# EAGLE board cs_debug_v1.1 (EAGLE 9.6.1), part 1 of 2
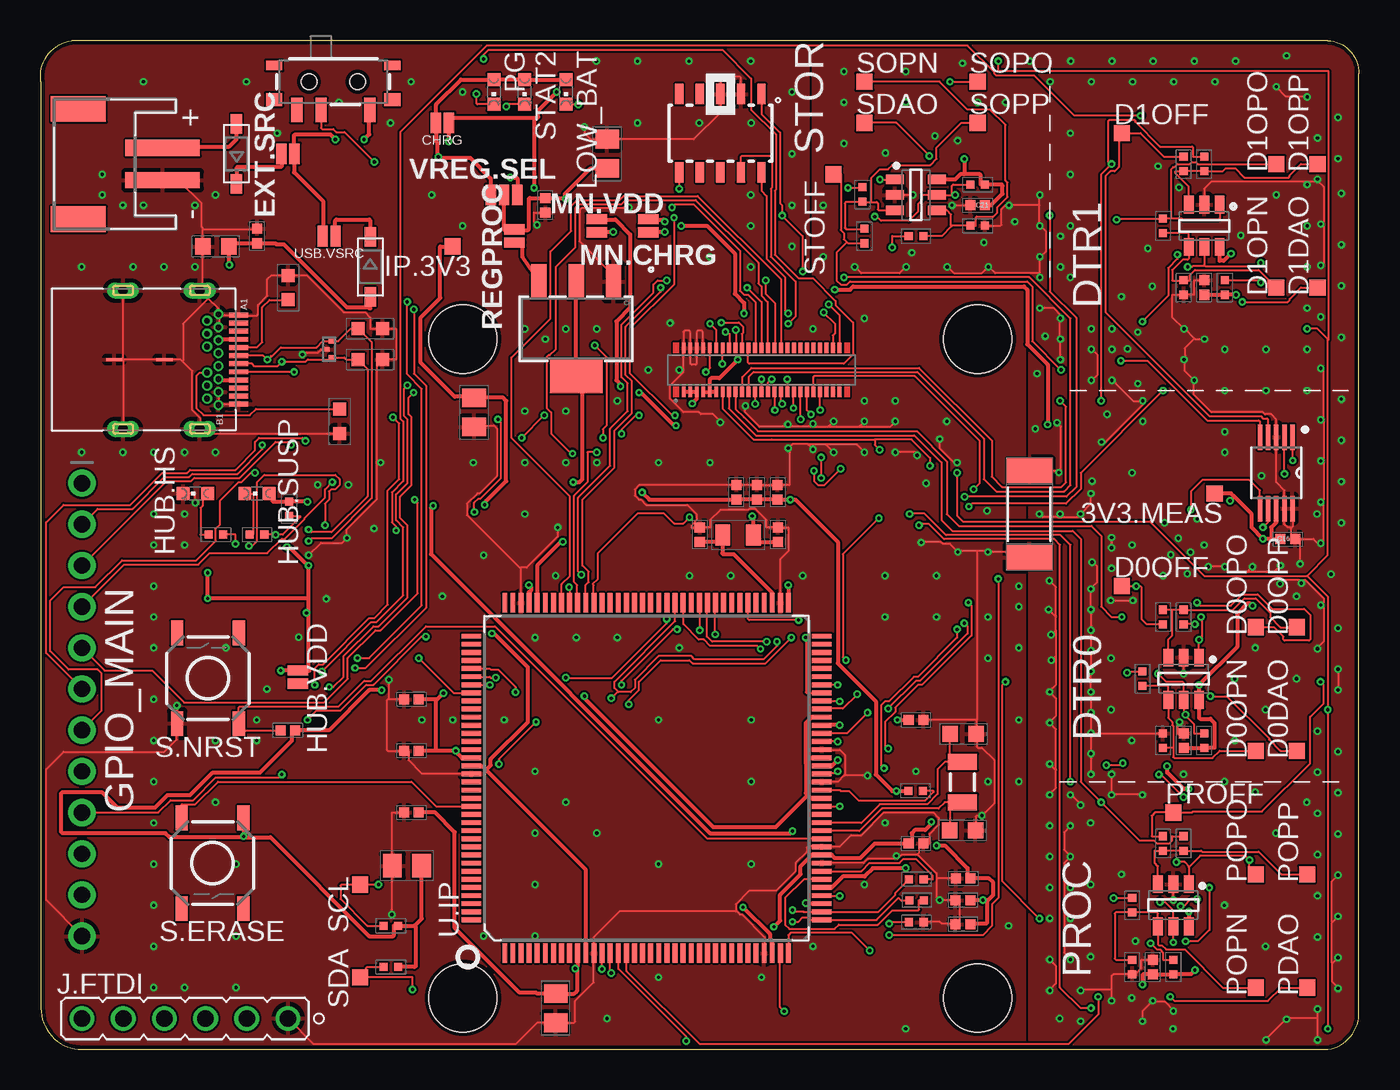
[diagram p10: board, top side]
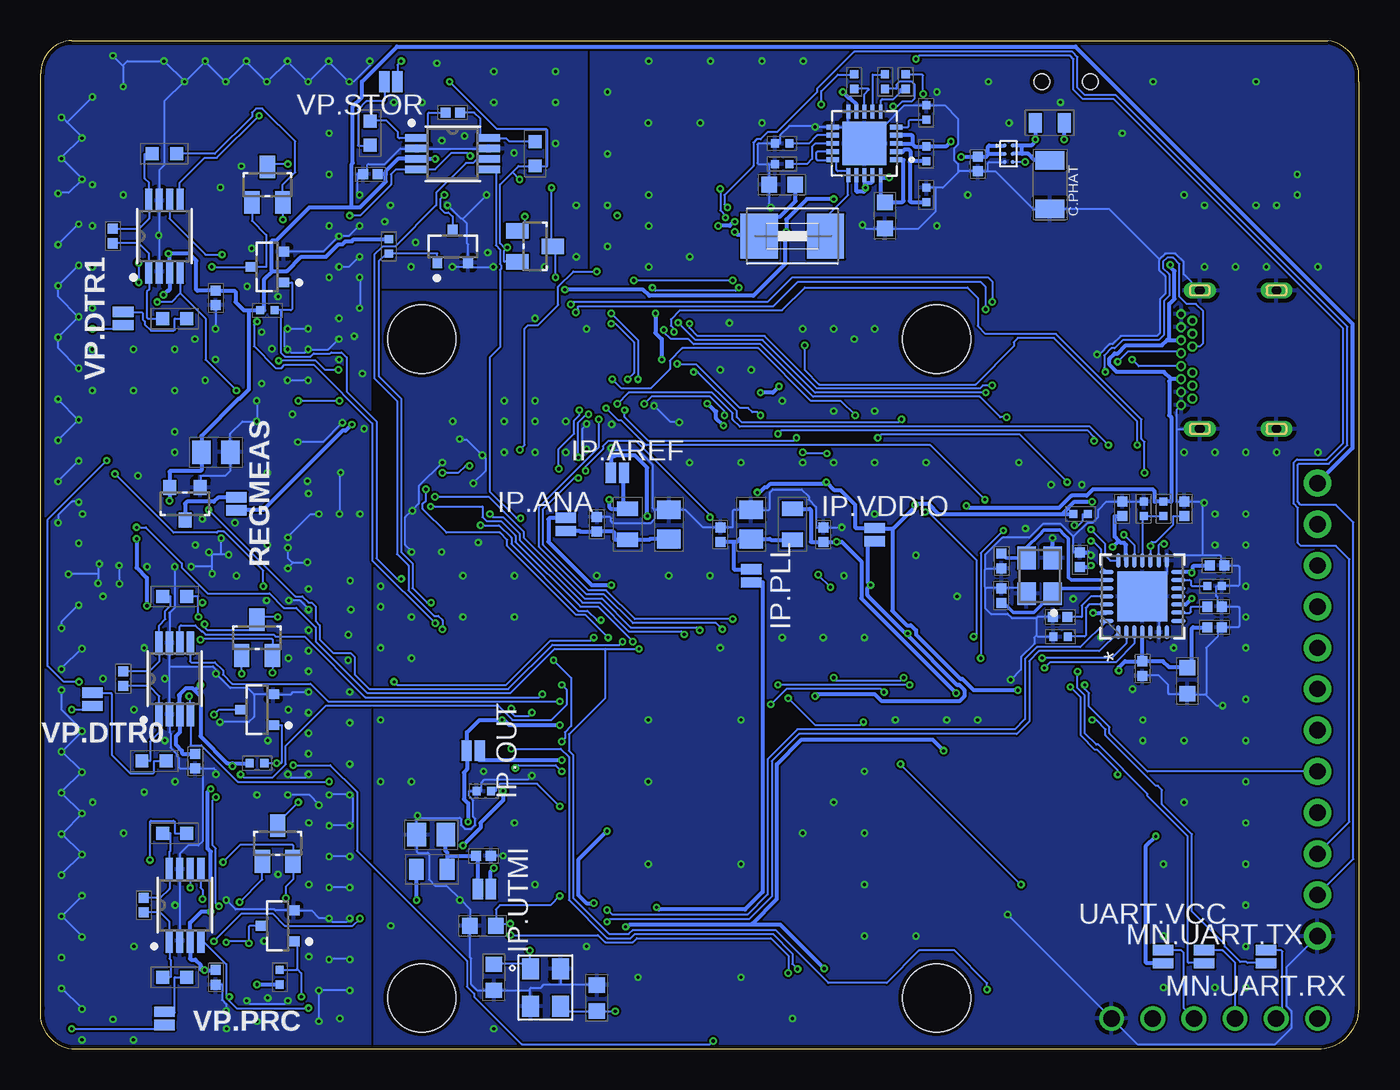
[diagram p11: board, bottom side, seen from below]

Size 81.32 x 62.23 mm. Coordinates in mm from the lower left corner, seen from the top.
Outline: 2.56,0 79.4,0 arc90 81.3,2.54 81.3,60.2 arc90 79.4,62.23 1.93,62.23 arc90 0.02,59.69 0.02,2.54 arc90 2.56,0
Copper layers (1*16): Top 0.035mm / dielectric 1.5mm / Bottom 0.035mm
Design rules "default *": minimum track width 5mil, minimum drill 0.2mm, track to track 5mil, track to pad 5mil, pad to pad 5mil, via to via 5mil, smd to smd 5mil, copper to edge 10mil, drill to drill 5mil, minimum pad ring 5mil, minimum via ring 5mil, stop-mask expansion 4mil, vias tented up to drill 0mil, thermal gap 10mil
Net classes: 1 power: width 0.254 mm; 2 power_5: width 0.254 mm; 5 10_mil: width 0.254 mm; 8 GND: width 0.127 mm
Holes 4.19 mm at 26.06,3.17 57.81,3.17 57.81,43.81 26.06,43.81

## Footprints (pad centres in the part's own frame; a part is rotated, then mirrored left to right if it is on the bottom)
TP10SQ = smd 1 x 1: TP 0,0
C0805 = smd 1.15 x 1.45: 1 -0.9,0; 2 0.9,0
C0402 = smd 0.62 x 0.62: 1 -0.45,0; 2 0.45,0
C0603 = smd 0.95 x 1: 1 -0.8,0; 2 0.8,0
C1206 = smd 1.15 x 1.8: 1 -1.5,0; 2 1.5,0
SMT-JUMPER_2_NC_PASTE_NO-SILK = smd 0.635 x 1.27: 1 -0.406,0; 2 0.406,0
SOD-123 = smd 1.2 x 0.7: A 1.85,0; C -1.85,0
1812 = smd 2.286 x 2.794: 1 -2.046,0; 2 2.046,0
CHIPLED_0603 = smd 0.8 x 0.8: A 0,-0.75; C 0,0.75
SAMTECH_FTSH-105-01 = smd 0.508 x 1.27: 1 -2.54,-2.413; 2 -2.54,2.413; 3 -1.27,-2.413; 4 -1.27,2.413; 5 0,-2.413; 6 0,2.413; 7 1.27,-2.413; 8 1.27,2.413; 9 2.54,-2.413; 10 2.54,2.413
HRS_DF40C-50DP-0.4V(51) = smd 0.23 x 0.66: 1 -4.8,1.355; 2 -4.8,-1.355; 3 -4.4,1.355; 4 -4.4,-1.355; 5 -4,1.355; 6 -4,-1.355; 7 -3.6,1.355; 8 -3.6,-1.355; 9 -3.2,1.355; 10 -3.2,-1.355; 11 -2.8,1.355; 12 -2.8,-1.355; 13 -2.4,1.355; 14 -2.4,-1.355; 15 -2,1.355; 16 -2,-1.355; 17 -1.6,1.355; 18 -1.6,-1.355; 19 -1.2,1.355; 20 -1.2,-1.355; 21 -0.8,1.355; 22 -0.8,-1.355; 23 -0.4,1.355; 24 -0.4,-1.355; 25 0,1.355; 26 0,-1.355; 27 0.4,1.355; 28 0.4,-1.355; 29 0.8,1.355; 30 0.8,-1.355; 31 1.2,1.355; 32 1.2,-1.355; 33 1.6,1.355; 34 1.6,-1.355; 35 2,1.355; 36 2,-1.355; 37 2.4,1.355; 38 2.4,-1.355; 39 2.8,1.355; 40 2.8,-1.355; 41 3.2,1.355; 42 3.2,-1.355; 43 3.6,1.355; 44 3.6,-1.355; 45 4,1.355; 46 4,-1.355; 47 4.4,1.355; 48 4.4,-1.355; 49 4.8,1.355; 50 4.8,-1.355
632723X00011 = smd 0.3 x 1.2: A1 -2.75,4.58; A2 -2.25,4.58; A3 -1.75,4.58; A4 -1.25,4.58; A5 -0.75,4.58; A6 -0.25,4.58; A7 0.25,4.58; A8 0.75,4.58; A9 1.25,4.58; A10 1.75,4.58; A11 2.25,4.58; A12 2.75,4.58 | drill 0.35 pad 0.584: B1 2.8,3.33; B2 2.4,2.63; B3 1.6,2.63; B4 1.2,3.33; B5 0.8,2.63; B6 0.4,3.33; B7 -0.4,3.33; B8 -0.8,2.63; B9 -1.2,3.33; B10 -1.6,2.63; B11 -2.4,2.63; B12 -2.8,3.33; GND 2,3.33; GND1 -2,3.33 | drill 0.6 pad 1 long: Z1 -4.27,2.18; Z2 4.27,2.18; Z3 4.27,-2.55; Z4 -4.27,-2.55 | smd 0.2 x 1: Z5 0,0; Z6 0,-3.1
JST-PH-2-SMT-RA = smd 1 x 4.6: 1 1,-3.7; 2 -1,-3.7 | smd 1.6 x 3.4: NC1 -3.4,1.5; NC2 3.4,1.5
HEADER-1X6 = drill 1.016: 1 0,-6.35; 2 0,-3.81; 3 0,-1.27; 4 0,1.27; 5 0,3.81; 6 0,6.35
1X12_ROUND = drill 1 pad 1.676: 1 -13.97,0; 2 -11.43,0; 3 -8.89,0; 4 -6.35,0; 5 -3.81,0; 6 -1.27,0; 7 1.27,0; 8 3.81,0; 9 6.35,0; 10 8.89,0; 11 11.43,0; 12 13.97,0
0805 = smd 0.8 x 1.2: 1 -0.9,0; 2 0.9,0
L0805 = smd 0.9 x 1.3: 1 -0.95,0; 2 0.95,0
SOT23-3_FDN340P = smd 0.95 x 1.4: D 0,1.1; G -0.95,-1.1; S 0.95,-1.1
SOT23-3_2N7002P = smd 0.6 x 0.7: D 0,1; G -0.95,-1; S 0.95,-1
R0402 = smd 0.5 x 0.5: 1 -0.45,0; 2 0.45,0
R0603 = smd 0.8 x 0.8: 1 -0.75,0; 2 0.75,0
R2010 = smd 1.499 x 2.794: 1 -2.667,0; 2 2.667,0
SWITCH_SPST_SMD_A = smd 0.7 x 1.5: 1 -2.25,-1.75; 2 -0.75,-1.75; 3 2.25,-1.75 | smd 1 x 0.6: GND1 -3.65,1; GND3 3.65,1 | smd 1 x 0.8: GND2 -3.65,-1.1; GND4 3.65,-1.1 | hole 0.95: -1.5,0; 1.5,0
TACTILE_SWITCH_SMD_5.2MM = smd 1.524 x 0.762: 1 -2.794,1.905; 2 2.794,1.905; 3 -2.794,-1.905; 4 2.794,-1.905
SOT23-3_AP2120N = smd 0.8 x 0.9: GND -0.95,-1; IN 0,1; OUT 0.95,-1
DCY4 = smd 0.95 x 2.15: GND -2.3,-2.9; IN 2.3,-2.9; OUT 0,-2.9 | smd 3.25 x 2.15: OUT_TAB 0,2.9
DMY0003A = smd 0.3 x 0.3: 1 -0.125,0; 2 0.125,-0.5; 3 0.125,0.5
DGK-MSOP8_INA225 = smd 1.45 x 0.45: GND -2.2,0.325; GS0 2.2,-0.975; GS1 2.2,-0.325; IN+ -2.2,0.975; IN- 2.2,0.975; OUT -2.2,-0.975; REF 2.2,0.325; VS -2.2,-0.325
OPA357AIDBVTG4 = smd 1.1 x 0.6: ENABLE 1.3,0; IN+ -1.3,-0.95; IN- 1.3,-0.95; OUT -1.3,0.95; VREF+ 1.3,0.95; VREF- -1.3,0
DGS10 = smd 1.575 x 0.279: 1 -2.2,1; 2 -2.2,0.5; 3 -2.2,0; 4 -2.2,-0.5; 5 -2.2,-1; 6 2.2,-1; 7 2.2,-0.5; 8 2.2,0; 9 2.2,0.5; 10 2.2,1
QFN50P400X400X100-21N = smd 0.81 x 0.26: 1 -1.955,1; 2 -1.955,0.5; 3 -1.955,0; 4 -1.955,-0.5; 5 -1.955,-1; 11 1.955,-1; 12 1.955,-0.5; 13 1.955,0; 14 1.955,0.5; 15 1.955,1 | smd 0.26 x 0.81: 6 -1,-1.955; 7 -0.5,-1.955; 8 0,-1.955; 9 0.5,-1.955; 10 1,-1.955; 16 1,1.955; 17 0.5,1.955; 18 0,1.955; 19 -0.5,1.955; 20 -1,1.955 | smd 2.7 x 2.7: 21 0,0
QFN28_5X5MC_MCH = smd 0.89 x 0.28: 1 -2.21,1.5; 2 -2.21,1; 3 -2.21,0.5; 4 -2.21,0; 5 -2.21,-0.5; 6 -2.21,-1; 7 -2.21,-1.5; 15 2.21,-1.5; 16 2.21,-1; 17 2.21,-0.5; 18 2.21,0; 19 2.21,0.5; 20 2.21,1; 21 2.21,1.5 | smd 0.28 x 0.89: 8 -1.5,-2.21; 9 -1,-2.21; 10 -0.5,-2.21; 11 0,-2.21; 12 0.5,-2.21; 13 1,-2.21; 14 1.5,-2.21; 22 1.5,2.21; 23 1,2.21; 24 0.5,2.21; 25 0,2.21; 26 -0.5,2.21; 27 -1,2.21; 28 -1.5,2.21 | smd 3.1 x 3.1: 29 0,0
WLCSP6_2X3 = smd 0.254 x 0.254: A1 -0.25,0.5; A2 0.25,0.5; B1 -0.25,0; B2 0.25,0; C1 -0.25,-0.5; C2 0.25,-0.5
LQFP144 = smd 0.3 x 1.2: 1 -8.75,-10.8; 2 -8.25,-10.8; 3 -7.75,-10.8; 4 -7.25,-10.8; 5 -6.75,-10.8; 6 -6.25,-10.8; 7 -5.75,-10.8; 8 -5.25,-10.8; 9 -4.75,-10.8; 10 -4.25,-10.8; 11 -3.75,-10.8; 12 -3.25,-10.8; 13 -2.75,-10.8; 14 -2.25,-10.8; 15 -1.75,-10.8; 16 -1.25,-10.8; 17 -0.75,-10.8; 18 -0.25,-10.8; 19 0.25,-10.8; 20 0.75,-10.8; 21 1.25,-10.8; 22 1.75,-10.8; 23 2.25,-10.8; 24 2.75,-10.8; 25 3.25,-10.8; 26 3.75,-10.8; 27 4.25,-10.8; 28 4.75,-10.8; 29 5.25,-10.8; 30 5.75,-10.8; 31 6.25,-10.8; 32 6.75,-10.8; 33 7.25,-10.8; 34 7.75,-10.8; 35 8.25,-10.8; 36 8.75,-10.8; 73 8.75,10.8; 74 8.25,10.8; 75 7.75,10.8; 76 7.25,10.8; 77 6.75,10.8; 78 6.25,10.8; 79 5.75,10.8; 80 5.25,10.8; 81 4.75,10.8; 82 4.25,10.8; 83 3.75,10.8; 84 3.25,10.8; 85 2.75,10.8; 86 2.25,10.8; 87 1.75,10.8; 88 1.25,10.8; 89 0.75,10.8; 90 0.25,10.8; 91 -0.25,10.8; 92 -0.75,10.8; 93 -1.25,10.8; 94 -1.75,10.8; 95 -2.25,10.8; 96 -2.75,10.8; 97 -3.25,10.8; 98 -3.75,10.8; 99 -4.25,10.8; 100 -4.75,10.8; 101 -5.25,10.8; 102 -5.75,10.8; 103 -6.25,10.8; 104 -6.75,10.8; 105 -7.25,10.8; 106 -7.75,10.8; 107 -8.25,10.8; 108 -8.75,10.8 | smd 1.2 x 0.3: 37 10.8,-8.75; 38 10.8,-8.25; 39 10.8,-7.75; 40 10.8,-7.25; 41 10.8,-6.75; 42 10.8,-6.25; 43 10.8,-5.75; 44 10.8,-5.25; 45 10.8,-4.75; 46 10.8,-4.25; 47 10.8,-3.75; 48 10.8,-3.25; 49 10.8,-2.75; 50 10.8,-2.25; 51 10.8,-1.75; 52 10.8,-1.25; 53 10.8,-0.75; 54 10.8,-0.25; 55 10.8,0.25; 56 10.8,0.75; 57 10.8,1.25; 58 10.8,1.75; 59 10.8,2.25; 60 10.8,2.75; 61 10.8,3.25; 62 10.8,3.75; 63 10.8,4.25; 64 10.8,4.75; 65 10.8,5.25; 66 10.8,5.75; 67 10.8,6.25; 68 10.8,6.75; 69 10.8,7.25; 70 10.8,7.75; 71 10.8,8.25; 72 10.8,8.75; 109 -10.8,8.75; 110 -10.8,8.25; 111 -10.8,7.75; 112 -10.8,7.25; 113 -10.8,6.75; 114 -10.8,6.25; 115 -10.8,5.75; 116 -10.8,5.25; 117 -10.8,4.75; 118 -10.8,4.25; 119 -10.8,3.75; 120 -10.8,3.25; 121 -10.8,2.75; 122 -10.8,2.25; 123 -10.8,1.75; 124 -10.8,1.25; 125 -10.8,0.75; 126 -10.8,0.25; 127 -10.8,-0.25; 128 -10.8,-0.75; 129 -10.8,-1.25; 130 -10.8,-1.75; 131 -10.8,-2.25; 132 -10.8,-2.75; 133 -10.8,-3.25; 134 -10.8,-3.75; 135 -10.8,-4.25; 136 -10.8,-4.75; 137 -10.8,-5.25; 138 -10.8,-5.75; 139 -10.8,-6.25; 140 -10.8,-6.75; 141 -10.8,-7.25; 142 -10.8,-7.75; 143 -10.8,-8.25; 144 -10.8,-8.75
SMT-JUMPER_2_NO_PASTEFREE_NO-SILK = smd 0.635 x 1.27: 1 -0.406,0; 2 0.406,0
SMT-JUMPER_3_1-NC_PASTE_NO-SILK = smd 0.635 x 1.27: 1 -0.813,0; 2 0,0; 3 0.813,0
XTAL_EPSON_TSX3225 = smd 1.4 x 1.15: 1 -1.1,-0.8; 2 1.1,-0.8; 3 1.1,0.8; 4 -1.1,0.8
CRYSTAL-SMD-3.2X1.5MM = smd 1 x 1.8: P$1 -1.25,0; P$2 1.25,0
CRYSTAL-3.2-2.5 = smd 1.3 x 1.05: 1 -1.15,-0.925; 2 1.15,-0.925; 3 1.15,0.925; 4 -1.15,0.925

## Placement (x,y rotation side)
3V3.MEAS  TPTP10SQ  [TP10SQ]  72.41,34.29 180 top
C1  10u  [C0805]  70.51,36.83 0 bottom
C2  10u  [C0805]  26.74,39.29 270 top
C3  0.1u  [C0402]  31.14,52.07 270 top
C4  0.1u  [C0402]  8.91,27.3 0 bottom
C5  0.1u  [C0402]  18.44,26.67 180 bottom
C6  0.1u  [C0402]  74.95,8.89 270 bottom
C7  0.1u  [C0402]  76.22,22.86 270 bottom
C8  0.1u  [C0402]  68.6,5.08 90 top
C9  0.1u  [C0402]  70.51,4.45 270 bottom
C10  0.1u  [C0402]  55.9,57.78 180 bottom
C11  0.1u  [C0402]  70.51,19.05 90 top
C12  0.1u  [C0402]  71.78,17.78 270 bottom
C13  0.1u  [C0402]  76.86,50.16 270 bottom
C14  0.1u  [C0402]  71.78,46.99 90 top
C15  0.1u  [C0402]  70.51,46.35 270 bottom
C16  0.1u  [C0402]  76.93,31.47 0 top
C17  16pF  [C0603]  47.01,3.17 90 bottom
C18  4.7u  [C0603]  35.58,53.34 180 bottom
C19  16pF  [C0603]  53.36,4.45 270 bottom
C21  0.1u  [C0402]  57.81,52.07 180 top
C22  0.1u  [C0402]  45.49,31.75 90 top
C23  22u  [C0805]  31.77,2.54 270 top
C24  22u  [C0805]  37.49,32.38 90 bottom
C25  22u  [C0805]  42.57,32.38 90 bottom
C26  22u  [C0805]  57.22,13.23 180 bottom
C27  22u  [C0805]  22.6,11.33 180 top
C28  10n  [C0402]  15.26,19.68 180 top
C29  0.1u  [C0402]  40.66,31.75 90 top
C30  0.1u  [C0402]  54,12.7 0 top
C31  0.1u  [C0402]  22.88,14.61 180 top
C32  0.1u  [C0402]  33.04,31.75 90 bottom
C33  0.1u  [C0402]  22.88,18.41 180 top
C34  0.1u  [C0402]  54,20.32 0 top
C35  0.1u  [C0402]  22.88,21.59 180 top
C36  0.1u  [C0402]  39.39,31.75 90 bottom
C37  0.1u  [C0402]  56.89,9.19 180 top
C38  0.1u  [C0402]  56.92,10.54 180 top
C39  0.1u  [C0402]  56.89,7.72 180 top
C40  0.1u  [C0402]  45.46,34.37 90 top
C41  0.1u  [C0402]  44.19,34.37 90 top
C42  0.1u  [C0402]  42.92,34.37 90 top
C43  0.1u  [C0402]  54,11.94 0 bottom
C44  0.1u  [C0402]  47.01,32.38 90 bottom
C45  0.1u  [C0402]  60.98,53.98 180 bottom
C46  2.2uF  [C0603]  10.82,49.53 180 top
C47  1u  [C0402]  13.36,50.16 90 top
C48  0.1u  [C0402]  10.76,33.35 90 bottom
C49  0.1u  [C0402]  13.36,23.5 270 bottom
C50  0.1u  [C0402]  8.76,29.84 0 bottom
C51  0.1u  [C0402]  8.91,26.04 0 bottom
C52  0.1u  [C0402]  17.22,30.2 90 bottom
C53  0.1u  [C0402]  14.6,33.35 90 bottom
C54  4.7u  [C0603]  10.59,22.73 270 bottom
C55  18pF  [C0402]  22.07,27.99 90 bottom
C56  18pF  [C0402]  22.04,30.12 270 bottom
C57  1u  [C0402]  23.52,54.61 270 bottom
C103  16pF  [C0603]  56.92,19.46 0 top
C107  16pF  [C0603]  56.87,13.51 0 top
C108  10pF  [C0603]  54.05,7.62 180 bottom
C205  22u  [C0805]  34.95,55.24 90 top
C208  4.7u  [C0603]  29.23,51.44 270 bottom
C.PHAT  47u  [C1206]  19.07,53.34 270 bottom
CHRG  JUMPER-SMT_2_NC_PASTE_NO-SILK  [SMT-JUMPER_2_NC_PASTE_NO-SILK]  24.79,57.15 180 top
D0DAO  TPSTP10SQ  [TP10SQ]  77.49,18.41 90 top
D0OFF  TPSTP10SQ  [TP10SQ]  66.7,28.57 0 top
D0OPN  TPSTP10SQ  [TP10SQ]  74.95,18.41 90 top
D0OPO  TPSTP10SQ  [TP10SQ]  74.95,26.04 90 top
D0OPP  TPSTP10SQ  [TP10SQ]  77.49,26.04 90 top
D1  MBR120VLSFT3GOSCT-ND  [SOD-123]  12.09,55.24 90 top
D1DAO  TPSTP10SQ  [TP10SQ]  78.76,46.99 90 top
D1OFF  TPSTP10SQ  [TP10SQ]  66.7,56.52 180 top
D1OPN  TPSTP10SQ  [TP10SQ]  76.22,46.99 90 top
D1OPO  TPSTP10SQ  [TP10SQ]  76.22,54.61 90 top
D1OPP  TPSTP10SQ  [TP10SQ]  78.76,54.61 90 top
D2  MBR120VLSFT3GOSCT-ND  [SOD-123]  20.34,48.26 270 top
EXT.SRC  JUMPER-SMT_2_NC_PASTE_NO-SILK  [SMT-JUMPER_2_NC_PASTE_NO-SILK]  15.26,55.24 0 top
F2  MF-MSMF050-2  [1812]  34.95,50.16 0 bottom
HUB.HS  [CHIPLED_0603]  9.55,34.29 90 top
HUB.SUSP  [CHIPLED_0603]  13.36,34.29 90 top
HUB.VDD  JUMPER-SMT_2_NC_PASTE_NO-SILK  [SMT-JUMPER_2_NC_PASTE_NO-SILK]  15.87,22.96 90 top
IP.3V3  TPTP10SQ  [TP10SQ]  25.42,49.53 90 top
IP.ANA  JUMPER-SMT_2_NC_PASTE_NO-SILK  [SMT-JUMPER_2_NC_PASTE_NO-SILK]  48.92,32.38 270 bottom
IP.AREF  JUMPER-SMT_2_NC_PASTE_NO-SILK  [SMT-JUMPER_2_NC_PASTE_NO-SILK]  45.74,35.56 180 bottom
IP.OUT  JUMPER-SMT_2_NC_PASTE_NO-SILK  [SMT-JUMPER_2_NC_PASTE_NO-SILK]  54.63,18.41 180 bottom
IP.PLL  JUMPER-SMT_2_NC_PASTE_NO-SILK  [SMT-JUMPER_2_NC_PASTE_NO-SILK]  37.49,29.21 90 bottom
IP.UTMI  JUMPER-SMT_2_NC_PASTE_NO-SILK  [SMT-JUMPER_2_NC_PASTE_NO-SILK]  53.94,9.88 180 bottom
IP.VDDIO  JUMPER-SMT_2_NC_PASTE_NO-SILK  [SMT-JUMPER_2_NC_PASTE_NO-SILK]  29.87,31.75 90 bottom
J1  J-JTAG-CORTEX_SMD  [SAMTECH_FTSH-105-01]  41.93,56.52 180 top
J3  HIROSE-DF40_50-PIN_CONNECTORS-HEADER  [HRS_DF40C-50DP-0.4V(51)]  44.47,41.91 0 top
J5  J-WURTH-USBC  [632723X00011]  7.64,42.55 270 top
J19  Solar  [JST-PH-2-SMT-RA]  3.83,54.61 90 top
J.FTDI  J-SERIAL-PORT  [HEADER-1X6]  8.91,1.91 90 top
JP1  [1X12_ROUND]  2.56,20.95 270 top
L1  3.3µH/±20%/450mA  [0805]  19.07,57.15 180 bottom
L101  MH2029-300Y  [L0805]  45.11,32.38 270 bottom
L102  MH2029-300Y  [L0805]  57.2,11.1 0 bottom
L103  MH2029-300Y  [L0805]  43.02,31.72 180 top
L104  MH2029-300Y  [L0805]  34.95,32.38 270 bottom
LOW_BAT  [CHIPLED_0603]  32.41,59.05 180 top
MN.CHRG  JUMPER-SMT_2_NC_PASTE_NO-SILK  [SMT-JUMPER_2_NC_PASTE_NO-SILK]  37.49,50.8 90 top
MN.UART.RX  JUMPER-SMT_2_NC_PASTE_NO-SILK  [SMT-JUMPER_2_NC_PASTE_NO-SILK]  5.74,5.71 90 bottom
MN.UART.TX  JUMPER-SMT_2_NC_PASTE_NO-SILK  [SMT-JUMPER_2_NC_PASTE_NO-SILK]  9.55,5.71 90 bottom
MN.VDD  JUMPER-SMT_2_NC_PASTE_NO-SILK  [SMT-JUMPER_2_NC_PASTE_NO-SILK]  34.31,50.8 90 top
PDAO  TPSTP10SQ  [TP10SQ]  78.13,3.81 90 top
PG  [CHIPLED_0603]  27.96,59.05 180 top
POPN  TPSTP10SQ  [TP10SQ]  74.95,3.81 90 top
POPO  TPSTP10SQ  [TP10SQ]  74.95,10.79 90 top
POPP  TPSTP10SQ  [TP10SQ]  78.13,10.79 90 top
PROFF  TPSTP10SQ  [TP10SQ]  69.87,14.61 0 top
Q3  FDN340P  [SOT23-3_FDN340P]  66.7,12.7 0 bottom
Q4  2N7002P  [SOT23-3_2N7002P]  66.7,7.62 90 bottom
Q5  FDN340P  [SOT23-3_FDN340P]  67.33,53.34 0 bottom
Q6  2N7002P  [SOT23-3_2N7002P]  67.33,48.26 90 bottom
Q7  FDN340P  [SOT23-3_FDN340P]  67.97,25.4 0 bottom
Q8  2N7002P  [SOT23-3_2N7002P]  67.97,20.95 90 bottom
Q9  FDN340P  [SOT23-3_FDN340P]  50.82,49.53 270 bottom
Q10  2N7002P  [SOT23-3_2N7002P]  55.9,49.53 0 bottom
R1  51k  [R0402]  15.34,33.35 270 top
R2  1.5k  [R0402]  31.14,59.69 90 bottom
R3  1.5k  [R0402]  29.23,59.69 270 bottom
R4  4.7k  [R0402]  21.61,7.62 180 top
R5  4.7k  [R0402]  21.61,5.08 180 top
R6  1.15k  [R0402]  27.96,59.69 90 bottom
R7  100k  [R0402]  8.91,28.57 180 bottom
R8  100k  [R0402]  53.97,15.93 180 bottom
R9  750  [R0402]  13.36,31.75 0 top
R10  270  [R0402]  10.82,31.75 0 top
R16  249k  [R0402]  69.24,12.7 270 top
R17  10k  [R0402]  70.51,12.7 270 top
R18  100k  [R0402]  69.87,5.08 270 top
R19  10k  [R0402]  67.33,8.89 90 top
R20  249k  [R0402]  67.33,5.08 90 top
R21  10k  [R0402]  66.57,4.45 270 bottom
R22  5.1  [R0603]  73.05,13.34 180 bottom
R23  5.1  [R0603]  73.05,4.45 180 bottom
R24  249k  [R0402]  70.51,54.61 270 top
R25  249k  [R0402]  69.24,26.67 90 top
R26  10k  [R0402]  70.51,26.67 90 top
R27  100k  [R0402]  71.78,19.05 270 top
R28  10k  [R0402]  67.97,22.86 90 top
R29  249k  [R0402]  69.24,19.05 270 top
R30  10k  [R0402]  67.97,17.65 180 bottom
R31  5.1  [R0603]  73.05,27.94 180 bottom
R32  5.1  [R0603]  74.32,17.78 180 bottom
R33  10k  [R0402]  71.78,54.61 270 top
R34  100k  [R0402]  73.05,46.99 270 top
R35  10k  [R0402]  69.24,50.8 90 top
R36  249k  [R0402]  70.51,46.99 90 top
R37  10k  [R0402]  67.33,45.59 180 bottom
R38  5.1  [R0603]  73.68,55.24 180 bottom
R39  5.1  [R0603]  73.05,45.09 180 bottom
R40  249k  [R0402]  50.82,50.16 90 top
R41  100k  [R0402]  53.97,15.95 0 top
R42  5.1k  [R0603]  15.26,46.99 270 top
R43  5.1k  [R0603]  18.44,38.73 90 top
R46  100k  [R0402]  13.28,33.35 270 bottom
R47  100k  [R0402]  12.06,33.35 90 bottom
R48  12k  [R0402]  18.41,25.45 0 bottom
R49  100k  [R0402]  17.17,33.02 180 bottom
R53  10k  [R0402]  50.69,52.73 270 top
R54  100k  [R0402]  57.81,53.34 0 top
R55  10k  [R0402]  54,50.16 180 top
R56  249k  [R0402]  57.81,50.8 180 top
R57  10k  [R0402]  59.84,49.53 90 bottom
R58  5.1  [R0603]  50.82,55.24 90 bottom
R59  5.1  [R0603]  60.98,56.52 90 bottom
R101  39  [R0402]  54.02,10.49 0 top
R102  39  [R0402]  54.05,9.19 0 top
R103  6.8k  [R0402]  54.02,7.85 180 top
R201  270k  [R0402]  26.69,55.24 90 bottom
R202  100k  [R0402]  26.69,52.7 270 bottom
R203  2k  [R0402]  35.58,54.61 0 bottom
R204  100k  [R0402]  35.58,55.88 0 bottom
R206  10k  [R0402]  26.69,57.78 270 bottom
R.GND  0  [R2010]  60.98,33.02 90 top
REGMEAS  JUMPER-SMT_2_NC_PASTE_NO-SILK  [SMT-JUMPER_2_NC_PASTE_NO-SILK]  69.24,33.66 90 bottom
REGPROC  JUMPER-SMT_2_NC_PASTE_NO-SILK  [SMT-JUMPER_2_NC_PASTE_NO-SILK]  29.23,50.16 270 top
S201  [SWITCH_SPST_SMD_A]  18.05,59.69 0 top
S.ERASE  Momentary  [TACTILE_SWITCH_SMD_5.2MM]  10.61,11.48 270 top
S.NRST  Momentary  [TACTILE_SWITCH_SMD_5.2MM]  10.33,22.89 90 top
SCL  TPTP10SQ  [TP10SQ]  19.71,10.16 180 top
SDA  TPTP10SQ  [TP10SQ]  19.71,4.45 180 top
SDAO  TPSTP10SQ  [TP10SQ]  50.82,57.15 0 top
SOPN  TPSTP10SQ  [TP10SQ]  50.82,59.69 0 top
SOPO  TPSTP10SQ  [TP10SQ]  57.81,59.69 0 top
SOPP  TPSTP10SQ  [TP10SQ]  57.81,57.15 0 top
STAT2  [CHIPLED_0603]  29.87,59.05 180 top
STOFF  TPSTP10SQ  [TP10SQ]  48.92,53.98 90 top
U1  AP2120N-3.3TRG1  [SOT23-3_AP2120N]  72.41,33.66 180 bottom
U2  TLV1117LV33DCYR  [DCY4]  33.04,44.45 180 top
U3  ESD122DMYR  [DMY0003A]  17.8,43.18 0 top
U5  INA225AIDGK  [DGK-MSOP8_INA225]  72.41,8.89 90 bottom
U6  OPA357AIDBVTG4  [OPA357AIDBVTG4]  69.87,8.89 270 top
U7  INA225AIDGK  [DGK-MSOP8_INA225]  73.05,22.86 90 bottom
U8  OPA357AIDBVTG4  [OPA357AIDBVTG4]  70.51,22.86 270 top
U9  INA225AIDGK  [DGK-MSOP8_INA225]  73.68,50.16 90 bottom
U10  OPA357AIDBVTG4  [OPA357AIDBVTG4]  71.78,50.8 270 top
U11  DAC7574IDGS  [DGS10]  76.22,35.56 270 top
U12  MCP73871T-2CCI/ML  [QFN50P400X400X100-21N]  30.5,55.88 180 bottom
U13  USB2412-DZK  [QFN28_5X5MC_MCH]  13.36,27.94 90 bottom
U14  INA225AIDGK  [DGK-MSOP8_INA225]  55.9,55.24 0 bottom
U15  OPA357AIDBVTG4  [OPA357AIDBVTG4]  54,52.7 0 top
U204  LOADSWITCH-MIC94164  [WLCSP6_2X3]  21.61,55.24 0 bottom
U.IP  ATSAM3X8EA-AU  [LQFP144]  37.38,16.74 0 top
UART.VCC  JUMPER-SMT_2_NO_PASTEFREE  [SMT-JUMPER_2_NO_PASTEFREE_NO-SILK]  12.09,5.71 90 bottom
USB.VSRC  JUMPER-SMT_2_NC_PASTE_NO-SILK  [SMT-JUMPER_2_NC_PASTE_NO-SILK]  17.8,50.16 180 top
VP.DTR0  JUMPER-SMT_2_NC_PASTE_NO-SILK  [SMT-JUMPER_2_NC_PASTE_NO-SILK]  78.13,21.59 90 bottom
VP.DTR1  JUMPER-SMT_2_NC_PASTE_NO-SILK  [SMT-JUMPER_2_NC_PASTE_NO-SILK]  76.22,45.09 90 bottom
VP.PRC  JUMPER-SMT_2_NC_PASTE_NO-SILK  [SMT-JUMPER_2_NC_PASTE_NO-SILK]  73.68,1.91 90 bottom
VP.STOR  JUMPER-SMT_2_NC_PASTE_NO-SILK  [SMT-JUMPER_2_NC_PASTE_NO-SILK]  59.71,59.69 180 bottom
VR3  VARISTOR  [R0603]  20.34,42.55 0 top
VR4  VARISTOR  [R0603]  20.34,44.45 0 top
VREG.SEL  JUMPER-SMT_3_1-NC_PASTE_NO-SILK  [SMT-JUMPER_3_1-NC_PASTE_NO-SILK]  28.6,52.7 0 top
Y1  EPSON_TSX-3225_24.0000MF10Z-C3  [XTAL_EPSON_TSX3225]  19.71,29.21 90 bottom
Y101  32.768kHz  [CRYSTAL-SMD-3.2X1.5MM]  56.87,16.48 90 top
Y102  12MHz-12pF-K7  [CRYSTAL-3.2-2.5]  50.19,3.81 270 bottom

## Tracks (layer width: path | path; a pad name or v marks a point on that pad's centre or on a via)
3V3_INSTR_MEAS  (via drill 0.2)
  Top 0.254: C11.1 R27.2 71.84,18.61 72.41,18.61 72.41,20.13 72.16,20.38 71.52,20.38 71.46,20.45 71.46,21.53 U8.VREF+ 71.46,21.65 v71.46,22.48 73.81,24.83 73.81,26.86 74.44,27.5 74.63,27.5 v74.76,27.37 | v67.97,4 67.97,4.57 68.03,4.64 C8.1 68.66,4.64 R18.2 69.93,4.64 70.95,4.64 v71.2,4.89 | v70.82,8.51 70.82,7.62 U6.VREF+ | v69.49,17.46 69.49,17.08 70.51,16.07 v70.82,16.07 | 75.9,31.5 76.47,31.5 C16.1 | 75.9,31.5 75.9,32.19 76.22,32.51 U11.8 | 3V3.MEAS.TP 73.43,34.29 73.62,34.1 | 73.62,34.1 74.7,33.02 74.7,32.19 v75.39,31.5 75.9,31.5 | C21.1 58.63,52.07 59.33,52.77 59.33,53.28 59.27,53.34 R54.2 58,53.34 58,53.91 57.93,53.98 56.98,53.98 | 56.98,53.98 56.73,53.98 56.41,53.66 55.33,53.66 U15.VREF+ | C14.1 R34.2 73.11,46.55 v73.74,46.55 | v73.43,49.09 72.98,48.64 72.73,48.64 72.73,49.47 U10.VREF+ | v56.98,54.93 56.98,53.98 | v73.36,33.85 73.62,34.1
  Bottom 0.254: 69.49,17.65 69.81,17.65 71.46,19.3 71.46,21.78 71.81,22.13 | 69.49,17.65 R30.2 | 71.81,22.13 71.97,22.29 72.35,22.29 72.79,21.84 72.73,21.78 72.73,20.7 U7.VS 72.73,20.57 72.73,19.56 72.98,19.3 72.98,18.8 72.6,18.41 72.6,18.29 72.54,18.22 C12.1 | 71.81,22.13 v71.46,22.48 | v67.97,4 R21.2 | C9.1 v71.2,4.89 71.39,4.89 71.46,4.95 71.46,5.21 71.78,5.52 72.03,5.52 72.09,5.59 72.09,6.67 U5.VS 72.09,6.79 72.09,7.81 71.39,8.51 v70.82,8.51 70.82,12.19 71.01,12.38 71.01,15.88 v70.82,16.07 | v69.49,17.46 69.49,17.65 | v73.74,46.55 73.49,46.8 73.43,46.8 73.36,46.86 73.36,47.94 U9.VS 73.36,48.07 73.36,49.02 v73.43,49.09 72.16,49.09 71.71,48.64 71.71,46.86 71.65,46.8 70.57,46.8 C15.1 69.36,46.8 69.3,46.74 69.3,46.1 68.79,45.59 68.47,45.59 | 60.03,53.98 C45.1 | 60.03,53.98 60.03,54.17 59.27,54.93 58.12,54.93 U14.VS 58,54.93 v56.98,54.93 | 68.47,45.59 R37.2 67.52,45.59 67.52,47.5 67.01,48.01 | 67.01,48.01 66.12,48.01 65.24,48.9 63.71,48.9 62.95,49.66 62.7,49.66 62.5,49.85 62.12,49.85 62,49.97 R57.2 | 60.03,53.98 60.03,53.53 61.62,51.94 62.12,51.94 | 62.12,51.94 64.73,51.94 66.76,49.91 67.01,49.91 67.08,49.85 67.08,48.07 67.01,48.01 | 68.47,45.59 68.47,40.7 69.04,40.13 69.11,40.13 71.39,37.85 71.39,36.89 C1.1 71.39,35.75 71.46,35.69 73.3,35.69 73.36,35.62 U1.OUT 73.36,34.54 v73.36,33.85 | JP1.1 0.4,37.08 0.4,44.77 17.48,61.85 59.33,61.85 61.49,59.69 61.49,58.74 62.06,58.17 62.06,54.67 62.12,54.61 62.12,51.94 | v74.76,27.37 74.76,29.08 75.39,29.72 v75.39,31.5
3V3_INSTR_PROC  (via drill 0.2)
  Top 0.254: 58.38,9.14 58.38,7.81 58.31,7.75 57.36,7.75 C39.1 | 58.38,9.14 58.31,9.21 v58.12,9.21 57.36,9.21 C37.1 | 58.38,9.14 58.76,9.53 58.76,10.29 58.5,10.54 C38.1 57.17,10.54 57.17,11.18 55.77,12.57 v55.27,12.57 | R41.1 53.49,15.94 v52.79,15.94 52.53,15.94 51.52,16.95 51.52,21.46 49.17,23.81 49.17,31.3 46.57,33.91 v46.25,33.91 45.49,33.91 C40.1 45.36,33.91 44.28,33.91 C41.1 44.15,33.91 42.95,33.91 C42.1 42.82,33.91 37.55,33.91 v37.1,34.35 | R5.1 23.07,5.08 23.13,5.14 23.13,7.56 23.07,7.62 | 23.07,7.62 R4.1 21.8,7.62 21.8,7.05 21.74,6.99 20.28,6.99 14.18,13.08 12.59,13.08 v12.53,13.14 | 23.07,7.62 23.52,8.06 23.52,11.3 C27.1 | v12.53,13.14 12.53,14.22 S.ERASE.1 | v12.53,13.14 12.47,13.08 7.96,13.08 7.7,13.34 1.35,13.34 1.29,13.4 1.29,15.81 1.35,15.88 3.77,15.88 4.72,14.92 7.07,14.92 7.83,15.68 9.23,15.68 10.63,17.08 13.55,17.08 15.51,19.05 15.51,19.68 C28.1 17.8,19.68 20.28,22.16 v21.04,22.16 | U2.OUT U2.OUT_TAB 32.92,41.55 32.91,41.53 33.42,41.02 33.42,35.18 33.23,34.99 v32.85,34.99 | IP.3V3.TP 24.66,49.53 24.66,46.35 23.45,45.15 23.45,42.35 25.55,40.26 26.74,40.26 C2.1 28.53,40.19 28.72,40.01 28.72,35.05 27.39,33.72 v27.39,33.59 | HUB.SUSP.A 14.31,34.29 14.31,33.85 14.37,33.78 15.32,33.78 R1.1 15.45,33.78 v16.47,33.78
  Bottom 0.254: v58.12,9.21 58.12,11.05 L102.1 | IP.AREF.1 45.36,35.56 45.36,33.34 L101.1 45.42,33.34 46.12,33.34 46.25,33.47 v46.25,33.91 | v55.27,12.57 54.19,13.65 54.19,13.97 52.79,15.37 v52.79,15.94 | v12.53,13.14 13.16,12.51 13.16,5.4 13.1,5.33 12.09,5.33 UART.VCC.1 | 18.24,33.02 25.93,33.02 26.56,33.66 27.2,33.66 27.33,33.53 | 18.24,33.02 R49.2 | 28.72,32.13 27.33,33.53 | 28.72,32.13 29.87,32.13 IP.VDDIO.2 29.93,32.13 31.01,32.13 31.07,32.19 31.07,33.59 31.96,34.48 32.34,34.48 v32.85,34.99 32.85,34.86 36.34,34.86 36.53,34.67 36.66,34.67 36.98,34.35 v37.1,34.35 | v16.47,33.78 17.55,33.78 18.24,33.08 18.24,33.02 | v27.39,33.59 27.33,33.53 | v21.04,22.16 23.77,22.16 24.47,22.86 24.59,22.86 27.33,25.59 27.33,25.84 27.64,26.16 27.9,26.16 28.79,27.05 28.79,32.07 28.72,32.13
ADVREF
  Top 0.254: C29.1 42.06,31.3 42.06,31.69 L103.2 42.06,31.24 42.06,30.61 42.12,30.54 42.76,30.54 45.11,28.19 45.11,27.56 U.IP.75
ADVREF_PRE  (via drill 0.2)
  Top 0.254: C22.1 43.96,31.3 43.96,31.69 L103.1 43.96,31.81 43.96,32.83 v43.9,32.89
  Bottom 0.254: v43.9,32.89 43.9,35.88 44.66,36.64 45.87,36.64 45.93,36.58 46.06,36.58 46.12,36.51 46.12,35.56 IP.AREF.2
AGND  (via drill 0.2)
  Top 0.127: v50.21,48.26 50.25,48.26 50.63,47.88 52.98,47.88 53.36,48.26 v53.39,48.26 | v55.93,48.26 55.96,48.26 56.35,47.88 58.06,47.88 58.44,48.26 v58.47,48.26 58.5,48.26 58.89,47.88 61.62,47.88 | v56.22,52.07 C21.2 | v53.8,52.7 U15.VREF- | 62.89,43.81 62.89,42.55 v62.91,42.55 | 62.89,43.81 62.89,45.09 v62.91,45.09 62.95,45.09 62.95,45.28 62.5,45.72 v61.64,45.72 | 62.89,43.81 v62.91,43.81 | v64.82,41.27 64.85,41.27 65.17,41.59 65.17,42.86 64.85,43.18 v64.82,43.18 | R56.1 59.2,50.8 59.27,50.86 59.27,51.82 59.52,52.07 v59.74,52.07 61.62,52.07 | 61.62,47.88 61.62,48.9 v61.64,48.9 61.68,48.9 62,49.21 62,50.48 61.68,50.8 v61.64,50.8 61.62,50.8 61.62,52.07 | 61.62,47.88 61.62,47.62 v61.64,47.62 | 61.62,52.07 61.62,52.7 v61.64,52.7 | 67.97,40.01 67.39,40.01 66.12,41.27 v66.09,41.27 | v61.62,33.02 61.81,32.83 62.7,32.83 v62.89,33.02 62.76,32.83 63.96,32.83 v64.16,33.02 64.79,33.66 v64.79,34.29 | v62.71,38.66 62.95,38.42 62.95,35.75 62.82,35.62 v62.81,35.59 62.82,35.69 R.GND.2 | v66.06,31.57 v66.06,30.94 | v66.01,27.69 v67.38,27.69 | v64.87,30.05 64.92,30.04 65.17,29.78 65.17,28.83 64.79,28.45 v64.79,28.4 v64.79,27.13 v64.79,25.86 v64.79,24.59 v64.79,23.32 v64.79,22.05 v64.79,20.78 v64.79,19.51 64.79,19.49 | v66.06,16.97 66.06,15.75 | 66.06,15.75 67.97,15.75 v67.97,15.7 | 66.06,15.75 v66.06,15.7 | 64.79,19.49 v64.79,18.24 v64.79,16.97 | 64.79,19.49 R29.1 | v70.25,20.19 70.12,20.07 70.12,19.49 C11.2 | v70.51,23.18 U8.VREF- | v67.97,1.73 67.97,2.35 68.6,2.98 v68.6,3 68.6,2.92 69.36,2.92 69.87,2.41 v69.87,2.36 | v62.25,3.63 62.25,3.68 62.63,4.06 62.63,5.14 62.25,5.52 v62.25,5.54
  Top 0.127: 66.06,3.68 66.06,4.51 66.19,4.64 R20.1 | 66.06,3.68 v66.06,3 | R20.1 67.52,4.64 67.9,5.02 67.9,5.52 C8.2 | R20.1 | 66.06,3.68 64.16,3.68 v64.16,3.63 | v69.87,9.21 U6.VREF- | 62.6,26.7 62.63,26.67 62.63,25.84 62.6,25.81 | 62.6,26.7 v62.17,27.13 | 62.6,25.81 62.38,25.59 v62.33,25.58 | v62.23,28.91 62.25,28.89 62.63,28.51 62.63,26.73 62.6,26.7 | 62.6,24.23 62.63,24.26 62.63,25.78 62.6,25.81 | 62.6,24.23 62.38,24 v62.35,24 | 62.6,24.23 62.63,24.19 62.63,22.48 62.25,22.1 v62.25,22.05 62.25,22.04 62.63,21.65 62.63,20.57 62.25,20.19 v62.25,20.14 v62.25,20.13 62.63,19.75 62.63,17.27 62.6,17.24 | 63.17,10.38 63.14,10.41 63.14,11.49 63.52,11.87 v63.52,11.89 63.52,11.94 63.14,12.32 63.14,13.4 v63.52,13.78 v63.52,13.79 | 63.17,10.38 63.52,10.03 v63.52,9.98 | v64.16,15.06 64.16,15.11 63.52,15.75 v63.52,15.7 | 62.6,17.24 62.63,17.21 62.63,16.13 62.25,15.75 v62.25,15.7 | 62.6,17.24 v62.25,17.59 v62.25,17.6 | 63.17,8.48 63.14,8.51 63.14,10.35 63.17,10.38 | 63.17,8.48 63.52,8.13 v63.52,8.08 | v63.52,5.54 63.52,5.59 63.14,5.97 63.14,8.45 63.17,8.48 | 67.97,40.01 67.97,39.75 65.68,37.47 v65.45,37.47 | 67.97,40.01 v67.99,40.01 | 76.86,1.91 75.59,0.64 v75.59,0.58 | v78.76,2.49 78.76,1.91 | 78.76,1.91 v78.76,0.58 | 79.68,5.3 v80.03,5.65 v80.03,5.66 | 79.68,5.3 79.65,5.27 79.65,4.19 80.03,3.81 v80.03,3.76 | 78.76,1.91 76.86,1.91 | 76.86,1.91 v76.86,1.85 | 79.68,7.84 79.65,7.81 79.65,5.33 79.68,5.3 | 79.68,7.84 v80.03,8.19 v80.03,8.2 | v80.03,10.74 v80.03,10.73 79.65,10.35 79.65,7.87 79.68,7.84 | v78.96,48.36 79.01,48.39 79.14,48.51 79.14,50.74 79.01,50.86 v78.96,50.9 79.01,50.93 79.14,51.05 79.14,53.21 78.76,53.59 v78.76,53.67 78.76,53.66 78.63,53.53 72.22,53.53 71.78,53.09 U10.VREF-
  Top 0.127: v78.13,58.75 78.13,58.8 76.79,58.8 76.22,59.37 v76.22,59.38 | v80.03,23.44 v80.03,22.17 | v78.76,24.71 78.76,24.77 79.14,25.15 79.14,27.24 79.01,27.37 v78.96,27.41 79.01,27.43 79.14,27.56 79.14,27.81 78,28.96 77.62,28.96 77.59,28.92 | 77.59,28.92 77.74,28.77 v77.77,28.75 | 77.59,28.92 77.55,28.96 76.67,28.96 76.47,28.77 v76.45,28.73 | v72.03,29.77 72.03,29.78 73.05,29.78 v73.05,29.77 73.05,29.72 73.3,29.46 74.44,29.46 74.47,29.5 | 74.47,29.5 v74.75,29.77 | v76.47,29.84 76.09,29.46 74.51,29.46 74.47,29.5 | v78.96,42.01 79.01,41.97 79.14,41.85 79.14,38.99 79.01,38.86 v78.96,38.84 79.14,38.92 79.14,36.45 79.01,36.32 v78.96,36.3 79.14,36.39 79.14,33.91 79.01,33.78 v78.96,33.76 79.01,33.72 79.14,33.59 79.14,31.37 79.01,31.24 v78.96,31.22 78.95,31.24 78.76,31.24 78.51,31.5 77.68,31.5 | R36.1 71.14,46.55 71.14,47.43 C14.2 | 70.57,42.55 70.57,41.85 71.14,41.27 | v71.8,43.81 71.2,43.81 71.17,43.85 | 71.17,43.85 70.57,44.45 v70.53,44.45 70.51,44.45 69.81,45.15 69.81,46.55 R36.1 | 70.57,42.55 70.57,43.24 71.17,43.85 | 70.57,42.55 v70.53,42.55 | R36.1 | 77.68,31.5 77.43,31.5 C16.2 | 77.14,32.16 77.24,32.26 77.24,33.34 U11.10 | 77.14,32.16 77.11,32.13 77.11,31.5 77.36,31.5 C16.2 | 77.14,32.16 77.11,32.19 76.92,32.19 76.73,32.38 76.73,33.34 U11.9 76.73,33.4 76.73,34.48 76.22,34.99 U11.3 76.22,38.86 75.9,39.18 75.52,39.18 75.39,39.31 72.22,39.31 71.14,40.39 71.14,41.27 | 71.14,41.27 v71.17,41.27 | 77.68,31.5 77.68,29.97 v77.69,29.95 | 77.68,31.5 C16.2
  Bottom 0.127: 55.01,48.26 54.95,48.26 54.95,48.51 Q10.S | 55.01,48.26 v55.93,48.26 | v56.22,52.07 55.39,51.24 55.33,51.24 55.3,51.21 | 55.3,51.21 55.01,50.93 55.01,49.72 54.95,49.66 54.95,48.58 Q10.S | 55.3,51.21 v53.8,52.7 | v53.39,48.26 54.88,48.26 54.95,48.2 55.01,48.26 | 55.01,48.26 Q10.S | v67.99,40.01 67.97,40.01 67.97,38.73 v67.99,38.73 68.85,38.73 69.62,37.97 C1.2 | C1.2 69.62,35.69 69.93,35.37 71.46,35.37 U1.GND | C1.2 | v64.82,44.45 v66.09,44.45 66.12,44.45 66.25,44.32 66.25,43.31 66.12,43.18 v66.09,43.18 66.06,43.18 65.87,42.99 65.04,42.99 64.85,43.18 v64.82,43.18 63.58,43.18 62.95,43.81 v62.91,43.81 | v66.09,41.27 v64.82,41.27 | U14.REF 53.74,55.56 58.06,55.56 U14.GND 58.12,55.56 59.14,55.56 60.09,54.61 61.11,54.61 61.17,54.55 61.17,53.98 C45.2 61.81,53.98 61.81,52.83 61.68,52.7 v61.64,52.7 | v62.91,48.26 62.31,48.26 61.68,48.9 v61.64,48.9 | v61.64,50.8 61.68,50.8 62.31,50.16 v62.91,50.16 62.95,50.16 63.9,49.21 66.31,49.21 Q6.S | v61.64,45.72 61.62,45.72 61.62,47.62 v61.64,47.62 | v65.45,37.47 63.9,37.47 v62.71,38.66 | v62.89,33.02 62.89,35.5 62.82,35.56 v62.81,35.59 | 65.77,30 66.06,29.72 v66.06,29.67 | 65.77,30 65.74,30.04 64.92,30.04 v64.87,30.05 | v66.06,30.94 66.06,30.29 65.77,30 | v66.01,27.69 65.3,27.69 64.79,27.18 v64.79,27.13 | v64.79,16.97 64.79,16.95 64.98,16.76 65.87,16.76 66.06,16.95 v66.06,16.97 | v64.79,22.05 64.79,22.04 65.74,22.04 65.87,21.91 66.95,21.91 Q8.S 67.01,21.91 68.09,21.91 68.12,21.88 | v70.25,20.19 68.47,20.19 68.16,20.51 68.16,21.84 68.12,21.88 | 68.12,21.88 68.54,22.29 69.62,22.29 v70.51,23.18 70.51,23.43 70.7,23.62 73.36,23.62
  Bottom 0.127: v64.16,33.02 64.66,33.02 66.06,31.62 v66.06,31.57 | v69.87,2.36 69.87,2.79 70.12,3.05 70.12,4 C9.2 | v63.52,5.54 63.52,5.59 62.25,5.59 v62.25,5.54 | v64.16,1.73 v64.16,3.63 64.16,3.68 62.25,3.68 v62.25,3.63 | v68.6,3 68.6,2.98 68.41,2.79 66.25,2.79 66.06,2.98 v66.06,3 | v62.25,8.08 62.25,8.06 62.44,7.87 63.33,7.87 63.52,8.06 v63.52,8.08 63.52,8.13 64.16,8.13 64.6,8.57 65.68,8.57 Q4.S 65.74,8.57 66.82,8.57 66.89,8.64 69.3,8.64 v69.87,9.21 | v62.25,9.98 62.25,10.03 63.52,10.03 v63.52,9.98 | v62.25,11.89 62.25,11.94 63.52,11.94 v63.52,11.89 | 62.25,13.84 63.52,13.84 v63.52,13.79 | v63.52,15.7 63.52,15.75 62.25,15.75 v62.25,15.7 62.25,15.68 62.06,15.49 62.06,14.03 62.25,13.84 | 62.25,13.84 v62.25,13.79 | v66.06,15.7 66.06,15.68 64.73,15.68 64.16,15.11 v64.16,15.06 | U9.GND 74,48.01 74,52.32 U9.REF 74,52.39 74,54.23 73.68,54.55 73.68,58.48 72.47,59.69 v72.44,59.69 72.41,59.69 | v61.01,60.96 60.98,60.96 60.98,60.71 62,59.69 v62.28,59.69 62.31,59.69 63.52,60.9 v63.55,60.96 63.52,60.96 64.79,59.69 v64.82,59.69 64.85,59.69 66.06,60.9 v66.09,60.96 66.06,60.96 67.33,59.69 v67.36,59.69 67.39,59.69 68.6,60.9 v68.63,60.96 68.6,60.96 69.87,59.69 v69.9,59.69 69.93,59.69 71.14,60.9 v71.17,60.96 71.14,60.96 72.41,59.69 | 72.41,59.69 73.68,60.96 v73.71,60.96 75.97,60.96 76.25,60.67 | U5.GND 72.73,6.73 72.73,11.05 U5.REF 72.73,11.11 72.73,12.06 72.22,12.57 71.59,12.57 71.33,12.83 71.33,17.34 | v70.51,16.97 70.51,17.21 70.63,17.34 71.33,17.34 | C12.2 71.33,17.34 | C12.2 72.73,17.34 72.79,17.4 72.79,17.97 72.92,18.1 72.92,18.22 73.3,18.61 73.3,19.49 73.36,19.56 73.36,20.64 U7.GND 73.36,20.7 73.36,23.62
  Bottom 0.127: C12.2 | 73.36,23.62 73.36,25.02 U7.REF 73.36,25.08 73.36,26.92 73.05,27.24 v73.05,29.77 | 78.76,17.14 80.03,18.41 v80.03,18.36 79.97,18.41 v78.76,19.62 v78.76,19.63 78.76,19.68 80.03,20.95 v80.03,22.17 | 78.76,17.14 80.03,15.88 v80.03,15.82 v80.03,15.81 v78.76,14.54 | 78.76,17.14 v78.76,17.09 | 78.76,12.06 80.03,13.34 v80.03,13.28 79.97,13.34 v78.76,14.54 | 78.76,12.06 80.03,10.79 v80.03,10.74 | 78.76,12.06 v78.76,12.01 | v78.76,6.93 78.76,6.99 80.03,8.26 v80.03,8.2 79.97,8.26 v78.76,9.46 v78.76,9.47 | v78.76,2.49 78.76,2.54 80.03,3.81 v80.03,3.76 | v78.76,14.54 v78.76,14.55 | v78.96,48.36 79.01,48.32 80.22,47.12 v80.23,47.09 80.22,47.05 80.22,46.42 79.01,45.21 v78.96,45.19 79.01,45.15 80.22,43.94 v80.23,43.92 80.22,43.88 80.22,43.24 79.01,42.04 v78.96,42.01 | v80.23,49.63 80.22,49.66 79.01,50.86 v78.96,50.9 | v76.22,59.38 76.22,60.64 76.25,60.67 | 76.25,60.67 76.86,61.28 v76.86,61.29 | v80.23,52.81 80.22,52.83 79.59,52.83 78.76,53.66 v78.76,53.67 78.76,53.72 80.03,54.99 | 79.68,57.18 80.03,57.53 v80.03,57.48 | 79.68,57.18 78.76,56.26 | 78.76,56.26 80.03,54.99 | 78.76,56.26 v78.76,56.21 | 80.03,54.99 v80.03,54.94 | 79.68,57.18 78.13,58.74 v78.13,58.75 | v80.03,25.98 80.03,26.35 79.01,27.37 v78.96,27.41 | v80.03,23.44 80.03,23.5 78.76,24.77 v78.76,24.71 | v76.47,29.84 76.47,28.77 v76.45,28.73 | 77.74,29.34 77.74,28.77 v77.77,28.75 | 77.74,29.34 77.74,29.91 v77.69,29.95 | 77.74,29.34 79.59,29.34 v79.6,29.31 | 70.76,29.78 70.76,30.48 v70.94,30.66 70.76,30.54 70.19,30.54 | 70.76,29.78 70.76,29.34 v70.73,29.34 | 70.19,30.54 69.74,30.54 v69.72,30.5 | 70.19,30.54 70.19,31.5 v70.18,31.52
  Bottom 0.127: 70.76,29.78 72.03,29.78 v72.03,29.77 | v80.23,32.49 80.22,32.51 80.22,32.96 79.4,33.78 79.01,33.78 v78.96,33.76 | v80.23,35.03 80.22,35.05 79.01,36.26 v78.96,36.3 | v80.23,37.57 80.22,37.59 79.01,38.8 v78.96,38.84 79.01,38.86 80.22,40.07 v80.23,40.11 | C15.2 70.51,44.45 v70.53,44.45
  other vias: 63.52,47.62 63.52,50.8 63.52,53.98 63.52,56.52 59.53,58.42 57.81,58.42 53.36,58.42 53.36,60.33 49.55,60.33 49.55,58.42 49.55,55.88 48.28,52.07 48.28,48.9 53.74,49.15 58.19,49.78 60.09,51.05 56.56,56.06 55.16,56.34 52.12,55.3 56.87,60.83 68.93,54.48 68.3,49.4 68.58,47.07 66.67,46.43 67.05,43.21 67.69,44.25 67.69,41.07 65.78,39.17 67.33,35.56 67.33,31.11 69.24,29.21 71.78,31.11 73.05,36.83 73.05,38.1 73.05,40.64 73.05,43.18 75.59,43.18 75.59,40.64 78.13,40.64 78.13,43.18 78.13,45.72 78.13,48.26 78.13,50.8 78.13,53.34 76.22,52.7 74.04,50.22 70.23,53.16 75.31,35.38 78.74,33.02 77.47,27.94 66.04,24.13 66.04,20.95 67.31,19.05 73.02,16.51 74.93,15.88 75.56,20.95 73.66,19.05 73.66,22.86 74.93,24.77 77.47,22.86 78.1,15.24 76.2,13.34 64.77,13.97 64.77,10.16 66.67,10.79 64.77,5.71 62.86,1.91 67.31,3.17 69.85,1.27 75.56,6.35 73.02,8.89 67.53,6.68 71.34,32.72 61.97,43.99 61.46,41.68 61.36,38.28 64.87,35.05 69.34,32.49
  pour Top: 60.98,0 83.21,0 83.21,62.23 47.65,62.23 47.65,46.99 60.98,46.99
  pour Bottom: 60.98,0 83.21,0 83.21,62.23 47.65,62.23 47.65,46.99 60.98,46.99
BAT_CHG_PROG1
  Bottom 0.127: R203.2 34.06,54.61 33.74,54.93 33.74,55.69 33.55,55.88 U12.13
CC3
  Top 0.127: R42.2 15.26,46.23 14.12,46.23 13.67,45.78 13.67,43.62 13.36,43.31 12.28,43.31 J5.A5
CC4
  Top 0.127: R43.2 18.44,39.5 13.29,39.5 12.91,39.12 10.05,39.12 9.61,39.56 9.61,41.53 9.8,41.72 10.24,41.72 J5.B5
CHG_VPCC
  Bottom 0.254: 27.64,54.8 27.71,54.74 27.71,52.32 27.64,52.26 26.69,52.26 R202.2 | 27.64,54.8 R201.1 | 27.64,54.8 27.64,55.37 27.77,55.5 28.02,55.5 28.15,55.37 28.53,55.37 U12.2
CM_DIFFAMP_N4
  Bottom 0.127: C6.1 73.93,9.34 73.36,9.91 73.36,11.05 U5.IN- 73.36,11.11 73.36,12.19 73.3,12.26 73.3,13.34 R22.2
CM_DIFFAMP_P4
  Bottom 0.127: C6.2 73.93,8.45 73.36,7.87 73.36,6.73 U5.IN+ 73.36,6.67 73.36,5.59 73.3,5.52 73.3,4.45 R23.2
CM_DTR0_DCBIAS_SHUTDOWN  (via drill 0.2)
  Top 0.127: v39.83,0.51 39.83,0.76 35.64,4.95 35.64,5.91 U.IP.15 | v65.74,17.53 66.63,17.53 v66.76,17.65
  Bottom 0.127: R30.1 v66.76,17.65 66.5,17.65 66.44,17.72 66.44,20 66.95,20 Q8.G | v39.83,0.51 40.03,0.32 51.65,0.32 54.57,3.24 54.57,3.43 55.01,3.87 55.01,5.46 61.81,12.26 61.81,15.88 63.46,17.53 v65.74,17.53
CM_DTR0_DIFFAMP_GAIN0  (via drill 0.2)
  Top 0.127: v49.3,21.46 48.22,21.46 U.IP.64
  Bottom 0.127: v49.3,21.46 63.58,21.46 64.66,22.54 69.49,22.54 70.06,23.11 70.06,23.37 70.57,23.88 72.03,23.88 72.09,23.94 72.09,25.02 U7.GS0
CM_DTR0_DIFFAMP_GAIN1  (via drill 0.2)
  Top 0.127: v50.38,21.91 49.49,21.02 48.22,21.02 U.IP.63
  Bottom 0.127: v50.38,21.91 50.57,21.72 61.3,21.72 65.04,25.46 66.82,25.46 66.95,25.59 71.14,25.59 71.33,25.78 71.39,25.78 71.78,26.16 72.66,26.16 72.73,26.1 72.73,25.08 U7.GS1
CM_DTR0_DIFFAMP_N
  Bottom 0.127: C7.1 74.63,23.3 74,23.94 74,25.02 U7.IN- 74,25.08 74,26.16 73.62,26.54 73.62,27.05 73.3,27.37 73.3,27.94 R31.2
CM_DTR0_DIFFAMP_OUT  (via drill 0.2)
  Top 0.127: v63.52,16.51 63.52,31.11 62.91,31.73 55.85,31.73 54.53,33.05 53.64,33.05 v53.61,33.02 | D0DAO.TP 76.47,18.41 75.78,19.11 75.78,19.18 73.17,21.78 v72.16,21.78 | v41.61,25.59 41.61,27.5 U.IP.82
  Bottom 0.127: v63.52,16.51 69.15,16.51 71.4,18.76 72.07,18.76 U7.OUT 72.09,20.7 72.09,21.72 v72.16,21.78 | v41.61,25.59 41.8,25.78 45.04,25.78 46.82,27.56 47.9,27.56 51.77,31.43 51.77,31.81 52.79,32.83 53.42,32.83 v53.61,33.02
CM_DTR0_DIFFAMP_P3
  Bottom 0.127: C7.2 74.63,22.42 74,21.78 74,20.7 U7.IN+ 74,20.64 74,19.56 74.57,18.99 74.57,17.78 R32.2
CM_DTR0_OPAMP_ENABLE  (via drill 0.2)
  Top 0.127: 70.6,20.61 70.51,20.7 U8.ENABLE 70.51,22.61 70.44,22.67 69.43,22.67 v68.92,23.18 | 70.6,20.61 71.14,20.07 71.14,19.49 R27.1 | v70.63,20.64 70.6,20.61
  Bottom 0.127: Q8.D 70.31,20.95 v70.63,20.64 | v68.92,23.18 68.92,24.26 Q7.G
CM_DTR0_OPAMP_N
  Top 0.127: R28.1 69.55,22.42 69.55,21.59 U8.IN- 69.55,21.53 69.55,20.45 69.81,20.19 69.81,20 69.87,19.94 69.87,18.61 | 69.87,18.61 R29.2 | D0OPN.TP 72.73,18.41 72.28,17.97 69.93,17.97 69.87,18.03 69.87,18.61
CM_DTR0_OPAMP_OUT  (via drill 0.2)
  Top 0.127: v67.01,23.24 67.08,23.3 R28.2 | v71.59,26.67 71.59,26.48 71.65,26.42 71.65,25.46 v71.46,25.27 71.46,24.19 U8.OUT | D0OPO.TP 76.09,26.04 76.67,25.46 76.67,25.27 76.73,25.21 78.25,25.21 78.32,25.27 78.32,26.8 77.93,27.18 75.97,27.18 75.08,28.07 74.13,28.07 73.43,27.37 71.52,27.37 v71.33,27.56
  Bottom 0.127: v67.01,23.24 67.01,24.26 Q7.S 67.01,24.32 67.01,25.27 67.08,25.34 71.39,25.34 v71.46,25.27 | R31.1 71.59,27.94 71.59,27.56 | v71.59,26.67 71.59,27.56 | 71.59,27.56 v71.33,27.56
CM_DTR0_V_OFFSET_IN  (via drill 0.2)
  Top 0.127: D0OFF.TP v67.58,28.57 67.84,28.57 67.9,28.51 67.9,26.54 68.22,26.23 R25.1 | v76.73,35.5 76.73,37.72 U11.2
  Bottom 0.127: v76.73,35.5 73.11,31.88 70.44,31.88 70.38,31.94 70,31.94 67.58,29.53 v67.58,28.57
CM_DTR0_V_SENSE_N  (via drill 0.2)
  Top 0.127: J3.18 42.87,39.5 43.38,38.99 44.24,38.12 54.05,38.12 55.9,36.27 55.9,33.02 56.64,32.28 64.82,32.28 65.43,31.67 65.43,27.3 66.06,26.67 v66.7,26.67 | v71.2,26.23 R26.1
  Bottom 0.127: v66.7,26.67 67.8,26.67 Q7.D 67.97,25.84 71.01,25.84 71.2,26.04 v71.2,26.23
CM_DTR0_V_SENSE_P
  Bottom 0.127: R32.1 74.32,17.78 74.32,17.08 74.38,17.02 75.78,17.02 76.92,18.16 76.92,21.91 76.98,21.97 78.13,21.97 VP.DTR0.2
CM_DTR1_DCBIAS_SHUTDOWN  (via drill 0.2)
  Top 0.127: v35.2,4.7 35.14,4.76 35.14,5.91 U.IP.14 | v52.34,7.05 58.12,7.05 58.69,7.62 58.69,8.95 59.08,9.34 v59.08,29.02
  Bottom 0.127: 66.5,45.59 65.87,45.59 65.81,45.66 65.81,47.31 66.31,47.31 Q6.G | 66.5,45.59 R37.1 | v35.2,4.7 35.2,5.78 36.28,6.86 44.53,6.86 44.79,6.6 46.5,6.6 46.95,7.05 v52.34,7.05 | v59.08,29.02 59.33,29.02 60.6,30.29 60.6,38.73 62.44,40.58 62.44,42.67 62.76,42.99 63.39,42.99 63.46,42.93 64.47,42.93 64.66,42.74 66.25,42.74 66.5,42.99 66.5,45.59
CM_DTR1_DIFFAMP_GAIN0  (via drill 0.2)
  Top 0.127: v23.33,24.13 25.48,21.97 26.56,21.97 U.IP.116 | v21.93,32 21.93,32.26 21.67,32.51 21.67,34.35 22.37,35.05 22.37,38.73 22.18,38.92 22.18,56.58 27.52,61.91 57.17,61.91 58.82,60.26 58.82,60.2 58.95,60.07 61.3,60.07 63.77,57.59 v67.84,57.59
  Bottom 0.127: v23.33,24.13 23.33,30.61 v21.93,32 | v67.84,57.59 70.44,54.99 71.2,54.99 72.73,53.47 72.73,52.39 U9.GS0
CM_DTR1_DIFFAMP_GAIN1  (via drill 0.2)
  Top 0.127: v51.01,20.77 49.74,19.49 48.22,19.49 U.IP.60 | v52.28,21.02 54,22.73 54.25,22.73 57.17,25.65 57.17,26.1 v56.98,26.29 | v67.97,44.9 69.55,46.48 69.55,48.2 70.12,48.77 v70.12,49.02
  Bottom 0.127: v51.01,20.77 51.2,20.57 52.09,20.57 52.28,20.77 v52.28,21.02 | v56.98,26.29 60.85,30.16 60.85,38.61 64.47,42.23 66.25,42.23 66.44,42.04 66.82,42.04 68.16,43.37 68.16,44.7 v67.97,44.9 | v70.12,49.02 71.14,49.02 73.36,51.24 73.36,52.32 U9.GS1
CM_DTR1_DIFFAMP_N
  Bottom 0.127: C13.1 75.27,50.61 74.63,51.24 74.63,52.32 U9.IN- 74.63,52.39 74.63,53.47 74.89,53.72 74.89,55.24 R38.2
CM_DTR1_DIFFAMP_OUT  (via drill 0.2)
  Top 0.127: v69.24,40.64 64.16,35.56 64.16,34.56 63.25,33.66 57.43,33.66 v57.26,33.48 | D1DAO.TP 77.74,46.99 77.05,46.29 77.05,46.23 76.92,46.1 v74.13,46.1 | v44.79,25.15 41.42,25.15 41.1,25.46 41.1,27.5 U.IP.83
  Bottom 0.127: U9.OUT 72.71,46.65 72.7,46.64 | 72.7,46.64 71.14,45.09 71.14,42.55 v69.24,40.64 | v57.26,33.48 54.06,33.48 54.06,32.83 53.8,32.58 52.92,32.58 52.03,31.69 52.03,31.3 48.03,27.3 46.95,27.3 v44.79,25.15 | v74.13,46.1 73.24,46.1 72.7,46.64
CM_DTR1_DIFFAMP_P
  Bottom 0.127: C13.2 75.27,49.72 74.63,49.09 74.63,48.01 U9.IN+ 74.63,47.94 74.63,46.86 74.76,46.74 74.76,45.15 74.7,45.09 R39.2
CM_DTR1_OPAMP_N
  Top 0.127: R35.1 70.76,50.35 70.82,50.29 70.82,49.53 U10.IN- 70.82,49.47 70.82,48.77 70.76,48.7 70.44,48.7 69.81,48.07 69.81,47.43 R36.2 | D1OPN.TP 75.71,46.99 75.71,47.5 75.14,48.07 71.2,48.07 70.89,47.75 70.89,47.43 R36.2 | R36.2
CM_DTR1_OPAMP_OUT  (via drill 0.2)
  Top 0.127: 69.74,51.24 70.38,51.24 70.44,51.18 72.66,51.18 72.73,51.24 72.73,52.07 U10.OUT | 69.74,51.24 R35.2 | D1OPO.TP 71.39,54.61 71.27,54.74 71.01,54.74 70.89,54.61 70.12,54.61 69.93,54.42 69.87,54.42 69.74,54.29 69.74,51.24 | R35.2 66.44,51.24 v66.38,51.18 | R35.2
  Bottom 0.127: R38.1 70.57,55.24 68.28,57.53 68.28,57.78 68.03,58.04 67.65,58.04 65.62,56.01 65.62,54.1 66.38,53.34 66.38,52.26 Q5.S 66.38,52.2 v66.38,51.18
CM_DTR1_OPAMP_P
  Top 0.127: R33.2 R24.2 | R24.2 70,54.17 70,54.04 70.82,53.21 70.82,52.13 U10.IN+ | R24.2 | D1OPP.TP 77.74,54.61 77.05,53.91 77.05,53.85 76.98,53.78 74.25,53.78 73.68,54.36 73.11,54.36 72.92,54.17 R33.2 | R33.2
CM_DTR1_V_OFFSET_IN
  Top 0.127: R24.1 69.3,55.05 67.84,56.52 D1OFF.TP 66.5,56.52 66.5,54.42 66.25,54.17 66,54.17 65.68,53.85 65.68,45.47 72.09,39.05 75.27,39.05 75.39,38.92 75.65,38.92 75.71,38.86 75.71,37.78 U11.4
CM_DTR1_V_SENSE_N  (via drill 0.2)
  Top 0.127: J3.20 43.29,40.57 43.29,41.48 43.84,42.04 54.19,42.04 58.67,37.56 58.67,35.33 59.3,34.7 62.97,34.7 63.24,34.97 63.24,39.65 v62.89,40.01 | v65.43,40.01 65.43,53.98 v66.06,54.61 66,54.61 65.87,54.74 65.87,57.28 65.93,57.34 67.46,57.34 67.52,57.28 67.52,57.21 69.04,55.69 71.01,55.69 71.08,55.63 71.08,55.05 R33.1
  Bottom 0.127: v62.89,40.01 v65.43,40.01 | v66.06,54.61 67.16,54.61 Q5.D
CM_DTR1_V_SENSE_P
  Bottom 0.127: R39.1 73.05,45.09 73.05,44.39 73.11,44.32 74.51,44.32 74.89,44.7 74.89,44.9 75.01,45.02 75.01,45.4 75.08,45.47 76.22,45.47 VP.DTR1.2
CM_DTR_OPAMP_ENABLE  (via drill 0.2)
  Top 0.127: v75.27,47.31 75.14,47.43 R34.1 | v75.27,48.51 75.08,48.32 71.84,48.32 71.81,48.35 | 71.81,48.35 71.78,48.39 U10.ENABLE | v70.76,48.26 71.01,48.26 71.08,48.32 71.78,48.32 71.81,48.35
  Bottom 0.127: Q5.G 68.28,52.2 68.28,51.12 67.39,50.23 67.39,48.26 Q6.D v70.76,48.26 | v75.27,48.51 v75.27,47.31
CM_OPAMP_ENABLE4  (via drill 0.2)
  Top 0.127: v68.47,6.54 68.85,6.16 69.04,6.16 69.24,5.97 69.24,5.52 R18.1 | v69.87,6.6 U6.ENABLE 69.87,8.57 69.36,9.08 v69.04,9.08
  Bottom 0.127: 68.47,6.67 68.47,7.56 68.41,7.62 Q4.D | v69.87,6.6 69.81,6.67 68.47,6.67 | 68.47,6.67 v68.47,6.54 | v69.04,9.08 67.65,10.48 67.65,11.56 Q3.G
CM_OPAMP_N4
  Top 0.127: R19.1 66.31,8.45 66.25,8.38 66.25,5.59 66.31,5.52 R20.2 | POPN.TP 72.92,3.81 70.57,6.16 69.43,6.16 69.17,6.41 68.98,6.41 68.92,6.48 68.92,7.56 U6.IN- 68.92,7.62 68.92,8.38 68.85,8.45 R19.1 | R19.1
CM_OPAMP_OUT4  (via drill 0.2)
  Top 0.127: v66.19,9.34 R19.2 | POPO.TP 74.57,10.79 v74.57,11.68 74.32,11.94 71.52,11.94 70.85,11.27 | 70.85,11.27 70.82,11.24 70.82,10.22 U6.OUT | v70.06,11.56 70.57,11.56 70.85,11.27
  Bottom 0.127: v66.19,9.34 66.19,10.03 65.74,10.48 65.74,11.56 Q3.S 65.74,11.62 65.74,12.57 65.81,12.64 68.98,12.64 v70.06,11.56 | R22.1 73.05,13.34 73.05,14.03 73.11,14.1 74.51,14.1 74.57,14.03 v74.57,11.68
CM_OPAMP_P1
  Top 0.127: 50.69,52.26 49.68,52.26 49.61,52.2 49.61,50.67 49.68,50.61 R40.2 | SOPP.TP 56.79,57.15 55.27,55.63 55.27,54.93 54.88,54.55 52.53,54.55 52.28,54.29 51.77,54.29 51.26,53.78 51.26,52.26 | 50.69,52.26 51.26,52.26 | 50.69,52.26 R53.2 | 51.26,52.26 51.58,52.26 51.65,52.2 51.65,51.82 51.71,51.75 52.66,51.75 U15.IN+
CM_OPAMP_P3
  Top 0.127: R26.2 69.81,27.11 | 69.81,27.11 R25.2 | 69.81,27.11 69.81,25.53 69.55,25.27 69.55,24.19 U8.IN+ | D0OPP.TP 76.47,26.04 75.84,26.67 75.84,26.92 74.95,27.81 74.25,27.81 73.55,27.11 R26.2 | R26.2
CM_OPAMP_P4
  Top 0.127: R17.2 R16.2 | R16.2 68.73,12.26 68.73,11.49 68.92,11.3 68.92,10.22 U6.IN+ | R16.2 | POPP.TP 76.54,10.79 75.14,12.19 71.65,12.19 71.59,12.26 R17.2 | R17.2
CM_PROC_DCBIAS_SHUTDOWN  (via drill 0.2)
  Top 0.127: v65.24,3.24 65.24,2.16 63.39,0.32 40.66,0.32 36.15,4.83 36.15,5.91 U.IP.16
  Bottom 0.127: 65.49,4.95 65.55,4.89 R21.1 | 65.49,4.95 65.49,6.67 65.68,6.67 Q4.G | v65.24,3.24 65.24,4.7 65.49,4.95
CM_PROC_DIFFAMP_GAIN0  (via drill 0.2)
  Top 0.127: v49.17,22.48 48.22,22.48 U.IP.66 | v68.98,16.95 69.11,16.95 v70.51,15.56 | v70.31,8.83 70.51,8.83 70.95,9.27 v71.33,9.27
  Bottom 0.127: v49.17,22.48 48.85,22.16 48.85,21.27 49.8,20.32 52.22,20.32 53.11,21.21 63.71,21.21 66.19,18.73 66.19,17.59 67.01,16.76 68.79,16.76 v68.98,16.95 | v70.51,15.56 70.7,15.37 70.7,12.57 70.51,12.38 70.51,9.02 v70.31,8.83 | v71.33,9.27 71.33,9.84 71.46,9.97 71.46,11.05 U5.GS0
CM_PROC_DIFFAMP_GAIN1  (via drill 0.2)
  Top 0.127: v47.2,25.4 47.2,22.04 47.26,21.97 48.15,21.97 U.IP.65 | v59.52,22.67 59.33,22.48 59.33,10.35 v61.62,8.06 | v70.63,6.67 71.39,6.67 72.09,7.37 v72.09,9.97
  Bottom 0.127: v47.2,25.4 47.39,25.21 49.87,25.21 52.6,22.48 59.33,22.48 v59.52,22.67 | v61.62,8.06 62.06,7.62 66.25,7.62 67.01,8.38 68.92,8.38 v70.63,6.67 | v72.09,9.97 72.09,11.05 U5.GS1
CM_PROC_DIFFAMP_OUT  (via drill 0.2)
  Top 0.127: v64.79,2.54 64.16,2.54 62.89,3.81 62.89,31.11 62.53,31.47 55.73,31.47 54.79,32.41 54.19,32.41 v54.19,32.32 | PDAO.TP 76.54,3.81 75.71,2.98 69.93,2.98 v69.68,3.24 | v46.76,26.48 43.71,26.48 43.65,26.54 43.65,27.5 U.IP.78
  Bottom 0.127: U5.OUT 71.31,6.69 69.87,5.25 69.87,3.17 69.81,3.11 | 69.81,3.11 69.24,2.54 v64.79,2.54 | 69.81,3.11 v69.68,3.24 | v46.76,26.48 47.01,26.48 47.58,27.05 48.15,27.05 52.28,31.18 52.28,31.56 53.04,32.32 v54.19,32.32
CM_PROC_V_OFFSET_IN  (via drill 0.2)
  Top 0.127: R16.1 68.54,13.14 68.54,14.41 68.73,14.61 PROFF.TP 71.01,14.61 71.08,14.67 75.33,14.67 78.32,17.65 78.32,20.51 79.14,21.34 79.14,22.48 v78.95,22.67 | v77.24,36.32 77.24,37.72 U11.1
  Bottom 0.127: v77.24,36.32 80.88,32.68 80.88,23.65 79.9,22.67 v78.95,22.67
CM_PROC_V_SENSE_N  (via drill 0.2)
  Top 0.127: J3.16 42.46,39.53 44.12,37.87 53.9,37.87 55.57,36.2 55.57,32.65 56.24,31.98 63.67,31.98 64.16,31.5 64.16,16.51 v65.43,15.24 67.78,12.89 68.66,12.89 68.85,12.7 69.62,12.7 69.81,12.89 69.81,13.14 R17.1
  Bottom 0.127: v65.43,15.24 66.7,13.97 Q3.D
CM_PROC_V_SENSE_P
  Bottom 0.127: R23.1 73.05,4.45 73.05,2.29 73.68,2.29 VP.PRC.2
CM_STOR_DCBIAS_SHUTDOWN  (via drill 0.2)
  Top 0.127: v34.63,4.95 34.63,5.91 U.IP.13 | v52.28,18.54 52.09,18.73 52.09,20.19 52.73,20.83 52.73,21.08 54.12,22.48 54.38,22.48 57.42,25.53 57.42,27.37 v57.23,27.56
  Bottom 0.127: Q10.G 56.85,48.58 56.85,49.09 R57.1 59.99,49.08 60.46,48.61 60.46,41.52 59.08,40.13 59.08,30.67 58.38,29.97 58.38,28.45 57.49,27.56 v57.23,27.56 | v34.63,4.95 34.95,5.27 34.95,5.91 36.15,7.11 44.66,7.11 44.92,6.86 46.38,6.86 48.73,9.21 48.73,18.03 49.23,18.54 v52.28,18.54
CM_STOR_DIFFAMP_GAIN0  (via drill 0.2)
  Top 0.127: v49.17,18.99 48.22,18.99 U.IP.59 | v49.68,24 49.49,24.19 49.49,30.54 v51.71,32.77
  Bottom 0.127: v49.17,18.99 48.98,19.18 48.98,19.56 48.6,19.94 48.6,22.92 v49.68,24 | v51.71,32.77 51.96,32.77 53.61,34.42 53.61,42.67 52.98,43.31 52.98,48.07 52.92,48.13 52.92,48.39 52.98,48.45 52.98,49.34 53.23,49.59 53.23,54.29 53.68,54.29 U14.GS0
CM_STOR_DIFFAMP_GAIN1  (via drill 0.2)
  Top 0.127: v49.17,17.14 49.17,17.08 49.11,17.02 48.22,17.02 U.IP.55 | v52.03,17.34 51.84,17.53 51.84,21.21 52.09,21.46 52.34,21.46 53.87,22.99 54.12,22.99 56.54,25.4 v56.54,25.91
  Bottom 0.127: v49.17,17.14 49.55,17.53 51.84,17.53 v52.03,17.34 | v56.54,25.91 56.54,26.48 56.79,26.73 57.04,26.73 58.63,28.32 58.63,29.84 59.33,30.54 59.33,40.01 60.74,41.41 60.74,49.01 60.22,49.53 59.46,49.53 56.92,52.07 56.92,52.83 55.07,54.67 54.63,54.67 54.38,54.93 53.74,54.93 U14.GS1
CM_STOR_DIFFAMP_N1
  Bottom 0.127: C10.1 54.57,57.78 54.19,57.4 54.19,56.2 53.74,56.2 U14.IN- 53.68,56.2 52.6,56.2 52.41,56.01 50.82,56.01 R58.2
CM_STOR_DIFFAMP_OUT  (via drill 0.2)
  Top 0.127: v62.25,51.44 62.25,46.75 63.88,45.13 63.88,34.68 63.28,34.09 v57,34.09 | SDAO.TP 52.79,57.15 v54.82,55.12 | v40.66,25.84 40.66,27.5 U.IP.84
  Bottom 0.127: v62.25,51.44 61.62,51.44 59.71,53.34 59.71,53.98 59.42,54.27 U14.OUT 58.06,54.29 56.98,54.29 55.96,55.31 55.01,55.31 v54.82,55.12 | v57,34.09 53.69,34.09 53.68,34.1 51.52,31.94 51.52,31.56 47.77,27.81 46.69,27.81 44.92,26.04 40.85,26.04 v40.66,25.84
CM_STOR_DIFFAMP_P1
  Bottom 0.127: C10.2 57.36,57.78 57.42,57.72 57.42,56.2 58.06,56.2 U14.IN+ 58.12,56.2 59.2,56.2 59.27,56.26 59.27,56.58 59.96,57.28 R59.2
CM_STOR_OPAMP_ENABLE  (via drill 0.2)
  Top 0.127: R54.1 56.28,53.34 56.22,53.28 56.22,52.77 56.19,52.74 | 56.19,52.74 56.15,52.7 U15.ENABLE 54.38,52.7 54.38,52.39 54.12,52.13 54.12,51.69 53.55,51.12 51.84,51.12 51.58,51.37 v51.46,51.37 | v56.41,52.7 56.22,52.7 56.19,52.74